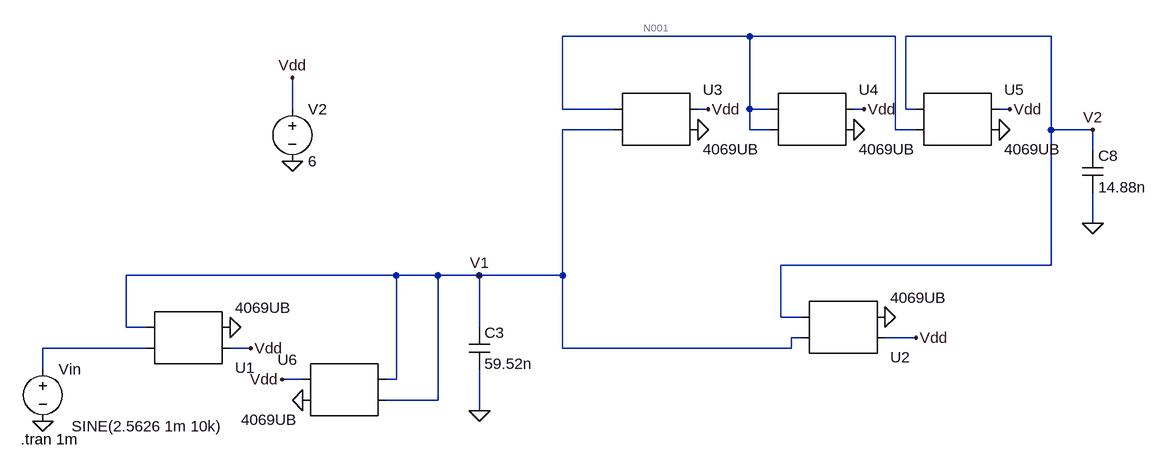
[diagram p0: schematic Q2.asc]
* Q2.asc
* U1: 4069UB (symbol AutoGenerated\4069UB not available, pins judged from their places): pin1=N002 pin2=V1 pin3=Vdd pin4=0
Vin N002 0 SINE(2.5626 1m 10k)
C3 V1 0 59.52n
* U2: 4069UB (symbol AutoGenerated\4069UB not available, pins judged from their places): pin1=V1 pin2=V2 pin3=Vdd pin4=0
* U3: 4069UB (symbol AutoGenerated\4069UB not available, pins judged from their places): pin1=N001 pin2=V1 pin3=Vdd pin4=0
* U4: 4069UB (symbol AutoGenerated\4069UB not available, pins judged from their places): pin1=N001 pin2=N001 pin3=Vdd pin4=0
* U5: 4069UB (symbol AutoGenerated\4069UB not available, pins judged from their places): pin1=V2 pin2=N001 pin3=Vdd pin4=0
V2 Vdd 0 6
C8 V2 0 14.88n
* U6: 4069UB (symbol AutoGenerated\4069UB not available, pins judged from their places): pin1=V1 pin2=V1 pin3=Vdd pin4=0
.tran 1m
.backanno
.end

* Results of the author's LTspice run, read from the files saved beside the schematic
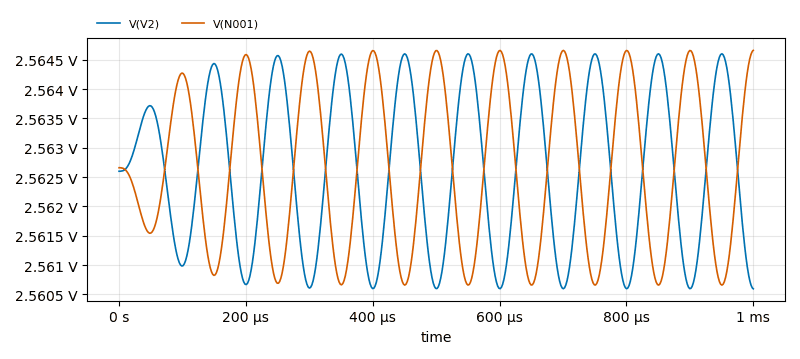
[diagram p1: Transient Analysis of Q2.asc, plotted from the saved traces]
* Transient Analysis, 1 run:
*   V(V2): min 2.561 V, max 2.565 V, average 2.563 V, rms 2.563 V, last 2.561 V
*   V(N001): min 2.561 V, max 2.565 V, average 2.563 V, rms 2.563 V, last 2.565 V